# Altium schematic sheet FPGA_PART2.SchDoc
size 420 x 297 mm; SheetNumber: 30; SheetTotal: 32
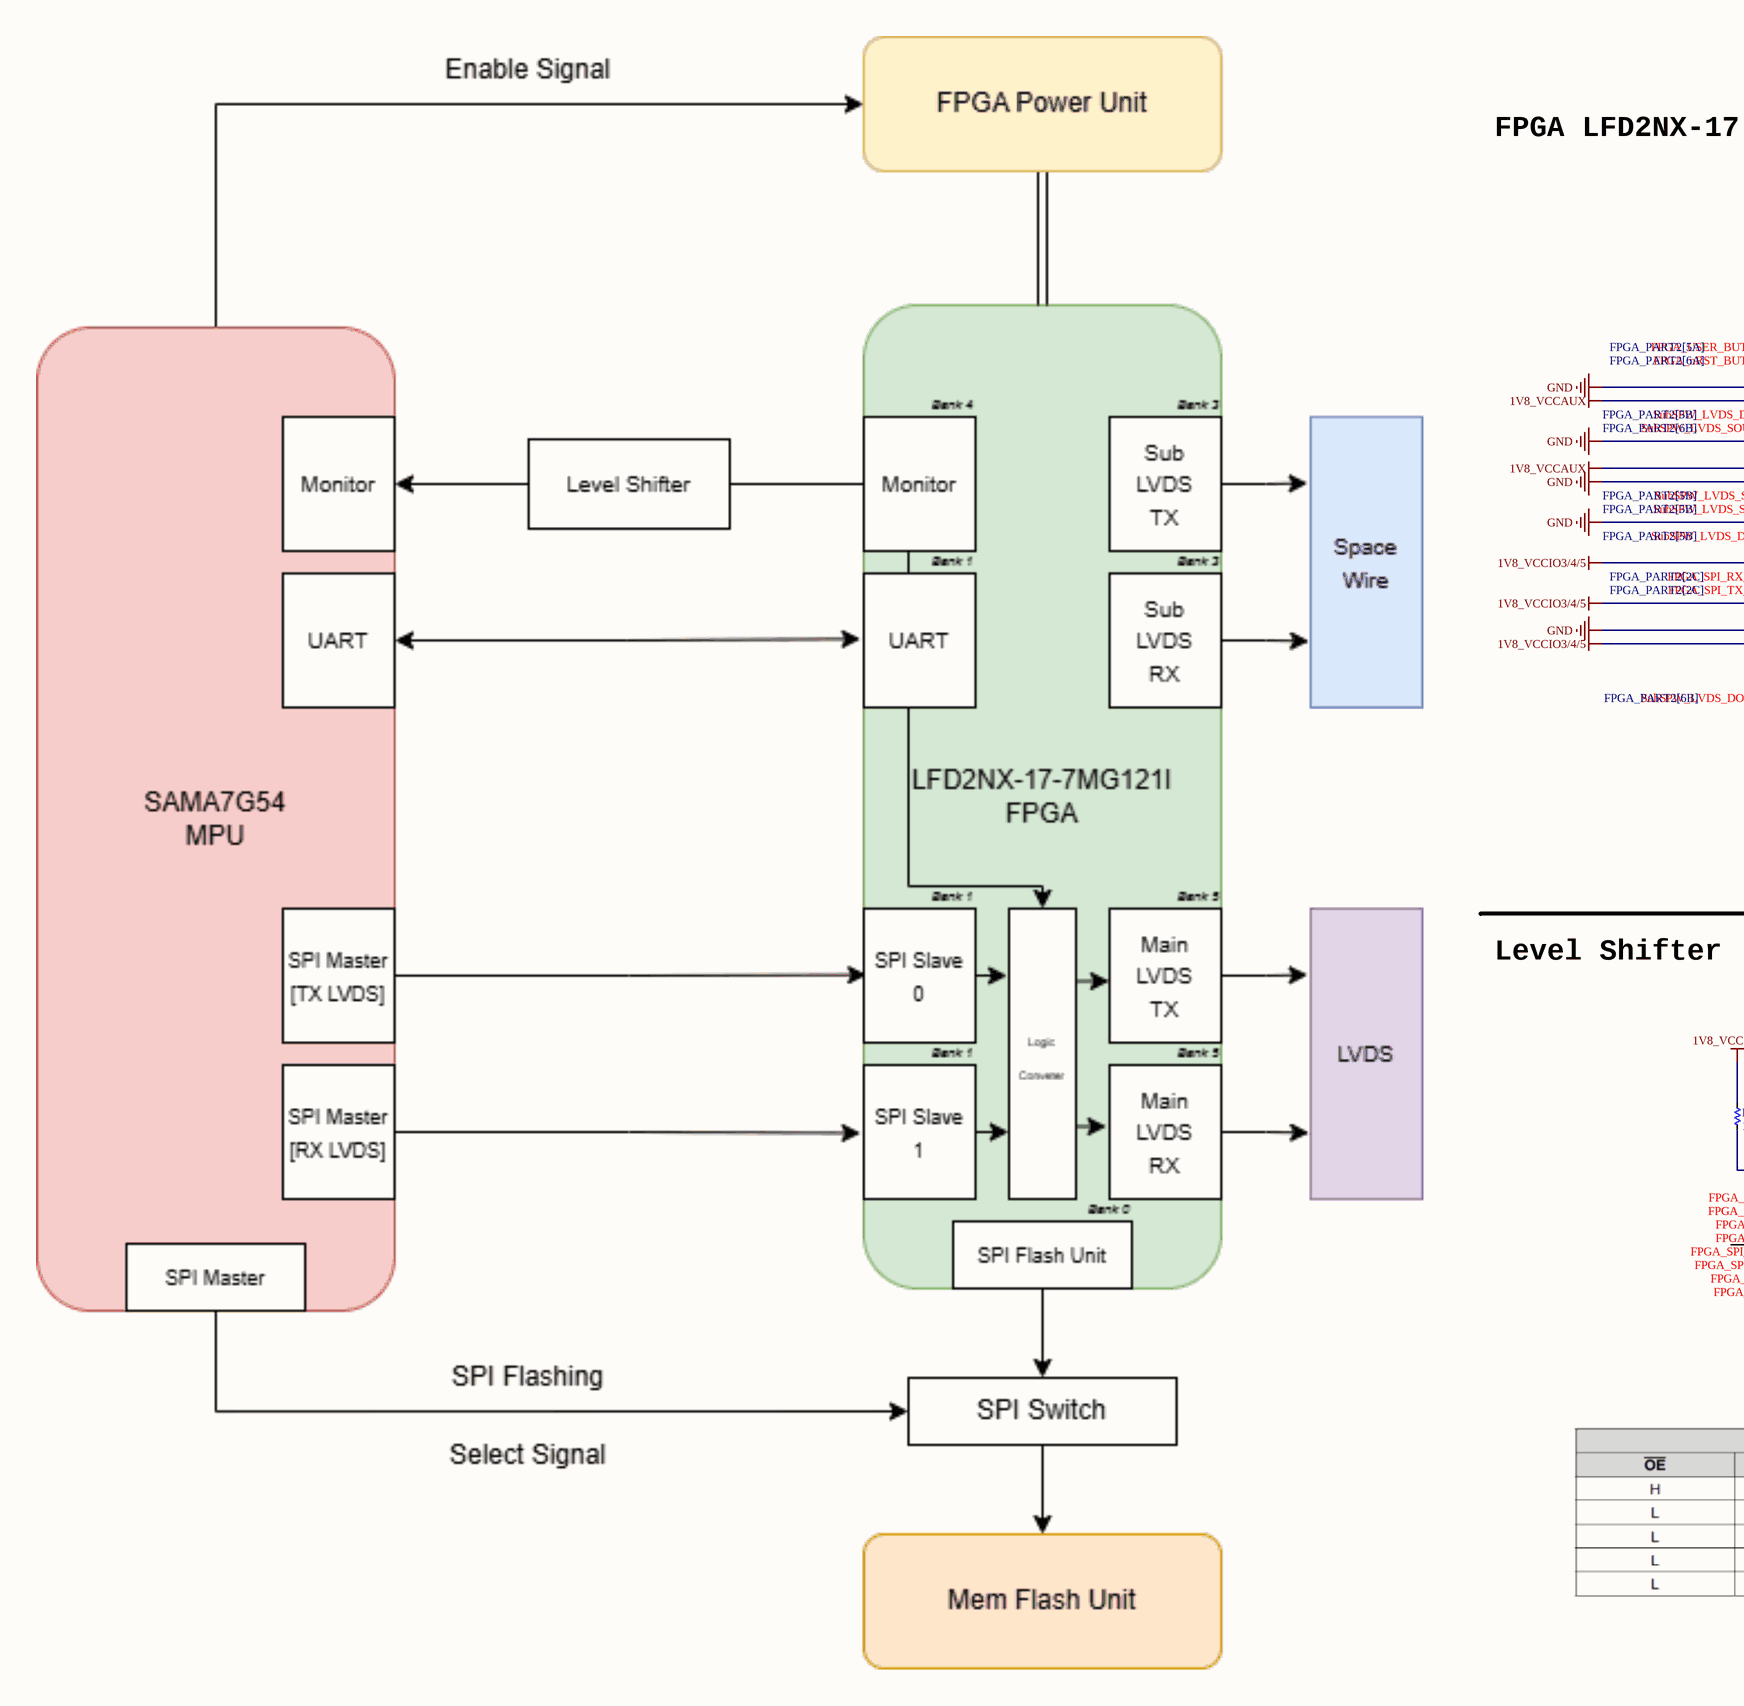
[diagram p0: FPGA_PART2.SchDoc, left]
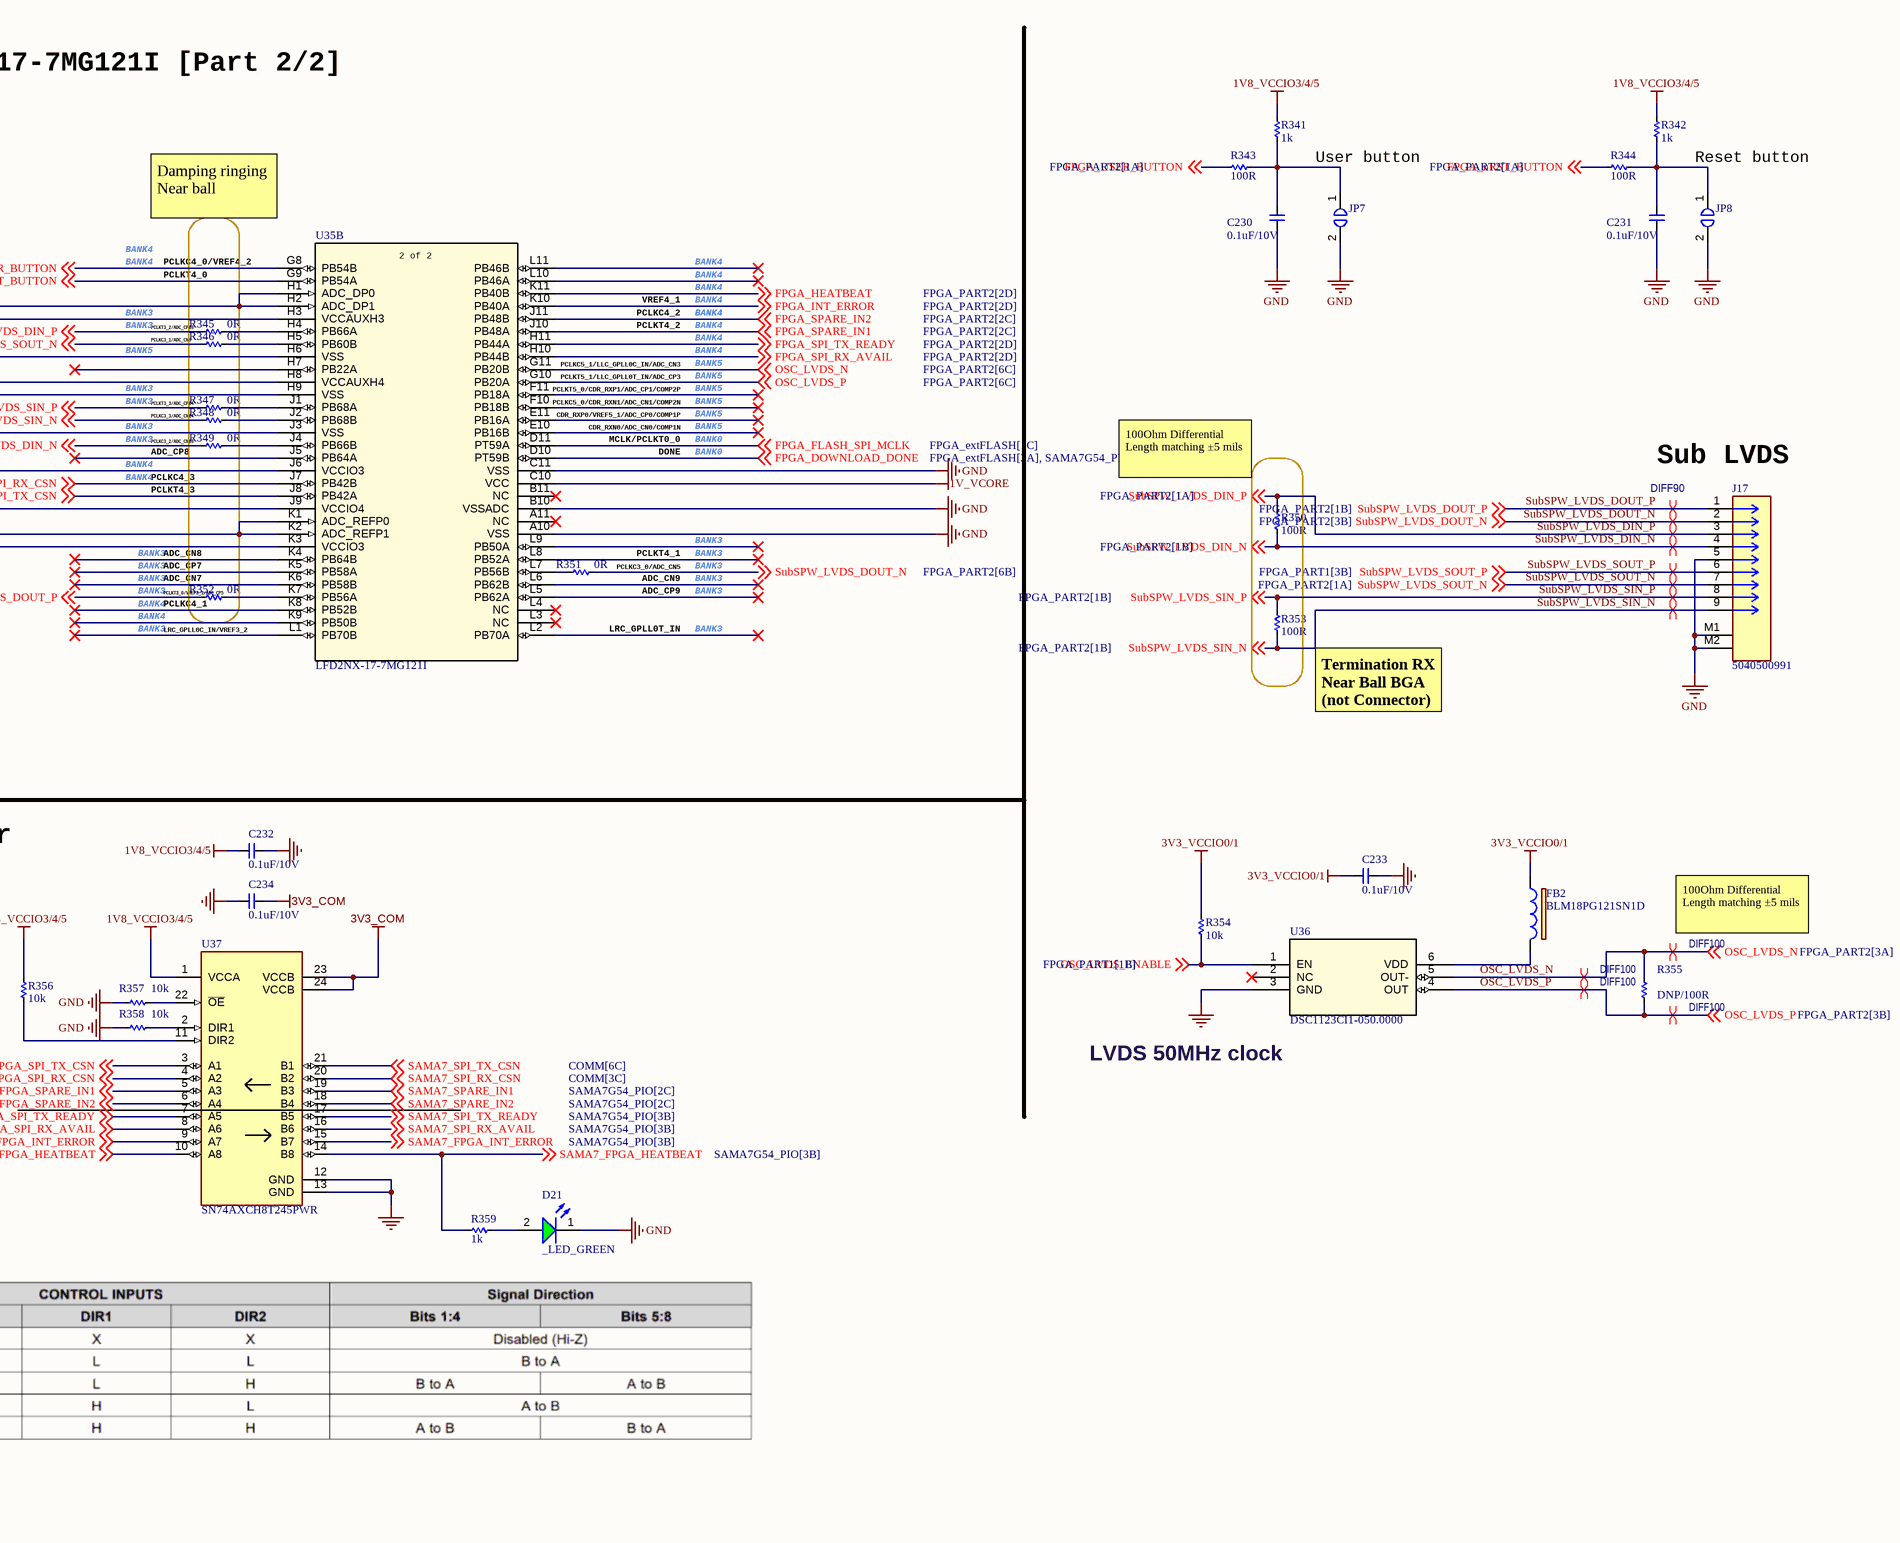
[diagram p1: FPGA_PART2.SchDoc, right]

## Parts
C230  0.1uF/10V  [CAP_C_1005X50_L]
C231  0.1uF/10V  [CAP_C_1005X50_L]
C232  0.1uF/10V  [CAP_C_1005X50_L]
C233  0.1uF/10V  [CAP_C_1005X50_L]
C234  0.1uF/10V  [CAP_C_1005X50_L]
D21  _LED_GREEN  [LED_0603]
FB2  BLM18PG121SN1D  [IND_C_1608X60]
J17  5040500991  [MOLEX_5040500991]
JP7  (no value)  [JUMPER_1608]
JP8  (no value)  [JUMPER_1608]
R341  1k  [RES_C_1005x30_L]
R342  1k  [RES_C_1005x30_L]
R343  100R  [RES_C_1005x30_L]
R344  100R  [RES_C_1005x30_L]
R345  0R  [RES_C_1005x30_L]
R346  0R  [RES_C_1005x30_L]
R347  0R  [RES_C_1005x30_L]
R348  0R  [RES_C_1005x30_L]
R349  0R  [RES_C_1005x30_L]
R350  100R  [RES_C_1005x30_L]
R351  0R  [RES_C_1005x30_L]
R352  0R  [RES_C_1005x30_L]
R353  100R  [RES_C_1005x30_L]
R354  10k  [RES_C_1005x30_L]
R355  DNP/100R  [RES_C_1005x30_L]
R356  10k  [RES_C_1005x30_L]
R357  10k  [RES_C_1005x30_L]
R358  10k  [RES_C_1005x30_L]
R359  1k  [RES_C_1005x30_L]
U35  LFD2NX-17-7MG121I  [csfBGA121_LAT]  (part B of 2)
U36  DSC1123CI1-050.0000  [VDFN6_3P2X2P5_MCH]
U37  SN74AXCH8T245PWR  [SOP65P640X120-24N]

## Nets
1V8_VCCAUX: U35.H3(VCCAUXH3) U35.H8(VCCAUXH4)
1V8_VCCIO3/4/5: C232.2 R341.2 R342.2 R356.2 U35.J6(VCCIO3) U35.J9(VCCIO4) U35.K3(VCCIO3) U37.1(VCCA)
1V_VCORE: U35.C10(VCC)
3V3_COM: C234.2 U37.23(VCCB) U37.24(VCCB)
3V3_VCCIO0/1: C233.2 FB2.2 R354.2
GND: C230.1 C231.1 C232.1 C233.1 C234.1 D21.1(K) J17.5 J17.M1 J17.M2 JP7.2 JP8.2 R357.1 R358.1 U35.A10(VSS) U35.B10(VSSADC) U35.C11(VSS) U35.H1(ADC_DP0) U35.H2(ADC_DP1) U35.H6(VSS) U35.H9(VSS) U35.J3(VSS) U35.K1(ADC_REFP0) U35.K2(ADC_REFP1) U36.3(GND) U37.12(GND) U37.13(GND)
FPGA_DOWNLOAD_DONE: U35.D10(PT59B) ; off-sheet FPGA_DOWNLOAD_DONE
FPGA_FLASH_SPI_MCLK: U35.D11(PT59A) ; off-sheet FPGA_FLASH_SPI_MCLK
FPGA_HEATBEAT: U35.K11(PB40B) U37.10(A8) ; off-sheet FPGA_HEATBEAT
FPGA_INT_ERROR: U35.K10(PB40A) U37.9(A7) ; off-sheet FPGA_INT_ERROR
FPGA_nRST_BUTTON: R344.1 U35.G9(PB54A) ; off-sheet FPGA_nRST_BUTTON
FPGA_SPARE_IN1: U35.J10(PB48A) U37.5(A3) ; off-sheet FPGA_SPARE_IN1
FPGA_SPARE_IN2: U35.J11(PB48B) U37.6(A4) ; off-sheet FPGA_SPARE_IN2
FPGA_SPI_RX_AVAIL: U35.H10(PB44B) U37.8(A6) ; off-sheet FPGA_SPI_RX_AVAIL
FPGA_SPI_RX_CSN: U35.J7(PB42B) U37.4(A2) ; off-sheet FPGA_SPI_RX_CSN
FPGA_SPI_TX_CSN: U35.J8(PB42A) U37.3(A1) ; off-sheet FPGA_SPI_TX_CSN
FPGA_SPI_TX_READY: U35.H11(PB44A) U37.7(A5) ; off-sheet FPGA_SPI_TX_READY
FPGA_USER_BUTTON: R343.1 U35.G8(PB54B) ; off-sheet FPGA_USER_BUTTON
OSC_LVDS_ENABLE: R354.1 U36.1(EN) ; off-sheet OSC_LVDS_ENABLE
OSC_LVDS_N: R355.1 U35.G11(PB20B) U36.5(OUT-) ; off-sheet OSC_LVDS_N
OSC_LVDS_P: R355.2 U35.G10(PB20A) U36.4(OUT) ; off-sheet OSC_LVDS_P
SAMA7_FPGA_HEATBEAT: R359.2 U37.14(B8) ; off-sheet SAMA7_FPGA_HEATBEAT
SAMA7_FPGA_INT_ERROR: U37.15(B7) ; off-sheet SAMA7_FPGA_INT_ERROR
SAMA7_SPARE_IN1: U37.19(B3) ; off-sheet SAMA7_SPARE_IN1
SAMA7_SPARE_IN2: U37.18(B4) ; off-sheet SAMA7_SPARE_IN2
SAMA7_SPI_RX_AVAIL: U37.16(B6) ; off-sheet SAMA7_SPI_RX_AVAIL
SAMA7_SPI_RX_CSN: U37.20(B2) ; off-sheet SAMA7_SPI_RX_CSN
SAMA7_SPI_TX_CSN: U37.21(B1) ; off-sheet SAMA7_SPI_TX_CSN
SAMA7_SPI_TX_READY: U37.17(B5) ; off-sheet SAMA7_SPI_TX_READY
SubSPW_LVDS_DIN_N: J17.4 R349.2 R350.2 ; off-sheet SubSPW_LVDS_DIN_N
SubSPW_LVDS_DIN_P: J17.3 R345.2 R350.1 ; off-sheet SubSPW_LVDS_DIN_P
SubSPW_LVDS_DOUT_N: J17.2 R351.1 ; off-sheet SubSPW_LVDS_DOUT_N
SubSPW_LVDS_DOUT_P: J17.1 R352.2 ; off-sheet SubSPW_LVDS_DOUT_P
SubSPW_LVDS_SIN_N: J17.9 R348.2 R353.2 ; off-sheet SubSPW_LVDS_SIN_N
SubSPW_LVDS_SIN_P: J17.8 R347.2 R353.1 ; off-sheet SubSPW_LVDS_SIN_P
SubSPW_LVDS_SOUT_N: J17.7 R346.2 ; off-sheet SubSPW_LVDS_SOUT_N
SubSPW_LVDS_SOUT_P: J17.6 ; off-sheet SubSPW_LVDS_SOUT_P
NetC230_2: C230.2 JP7.1 R341.1 R343.2
NetC231_2: C231.2 JP8.1 R342.1 R344.2
NetD21_2: D21.2(A) R359.1
NetFB2_1: FB2.1 U36.6(VDD)
NetR345_1: R345.1 U35.H4(PB66A)
NetR346_1: R346.1 U35.H5(PB60B)
NetR347_1: R347.1 U35.J1(PB68A)
NetR348_1: R348.1 U35.J2(PB68B)
NetR349_1: R349.1 U35.J4(PB66B)
NetR351_2: R351.2 U35.L7(PB56B)
NetR352_1: R352.1 U35.K7(PB56A)
NetR356_1: R356.1 U37.11(DIR2)
NetR357_2: R357.2 U37.22(~{OE})
NetR358_2: R358.2 U37.2(DIR1)

Not connected (* = marked no-connect by the designer): U35 A11(NC)* B11(NC)* E10(PB16B)* E11(PB16A)* F10(PB18B)* F11(PB18A)* H7(PB22A)* J5(PB64A)* K4(PB64B)* K5(PB58A)* K6(PB58B)* K8(PB52B)* K9(PB50B)* L1(PB70B)* L2(PB70A)* L3(NC)* L4(NC)* L5(PB62A)* L6(PB62B)* L8(PB52A)* L9(PB50A)* L10(PB46A)* L11(PB46B)*; U36 2(NC)*

## Layout directives
differential pair; differential pair class DIFF90; net class DIFF90; rule Matched Net Lengths [Tolerance = 4mil]: SubSPW_LVDS_DIN_N, SubSPW_LVDS_DIN_P, SubSPW_LVDS_DOUT_N, SubSPW_LVDS_DOUT_P, SubSPW_LVDS_SIN_N, SubSPW_LVDS_SIN_P, SubSPW_LVDS_SOUT_N, SubSPW_LVDS_SOUT_P
differential pair; differential pair class DIFF100; net class DIFF100; rule Matched Net Lengths [Tolerance = 4mil]: OSC_LVDS_N, OSC_LVDS_P

## Notes on the sheet
- FPGA LFD2NX-17-7MG121I [Part 2/2]
- User button
- Reset button
- Damping ringing
  Near ball
- BANK4
- PCLKC4_0/VREF4_2
- PCLKT4_0
- VREF4_1
- BANK3
- BANK5
- PCLKT3_2/ADC_CP13
- PCLKC3_1/ADC_CN6
- PCLKC5_1/LLC_GPLL0C_IN/ADC_CN3
- PCLKT4_2
- PCLKC4_2
- PCLKT3_3/ADC_CP14
- PCLKC3_3/ADC_CN14
- CDR_RXN0/ADC_CN0/COMP1N
- CDR_RXP0/VREF5_1/ADC_CP0/COMP1P
- PCLKC5_0/CDR_RXN1/ADC_CN1/COMP2N
- PCLKT5_0/CDR_RXP1/ADC_CP1/COMP2P
- PCLKT5_1/LLC_GPLL0T_IN/ADC_CP3
- PCLKC3_2/ADC_CN13
- ADC_CP8
- (near R349) PCLKC4_3
- PCLKT4_3
- DONE
- MCLK/PCLKT0_0
- BANK0
- (near R350) 100Ohm Differential
  Length matching ±5 mils
- (near J17) Sub LVDS
- (near R352) ADC_CN8
- PCLKT4_1
- (near R352) BANK3
- (near R352) BANK4
- (near R352) ADC_CP7
- (near R352) ADC_CN7
- (near R352) PCLKT3_0/VREF3_1/ADC_CP5
- (near R352) PCLKC4_1
- ADC_CP9
- ADC_CN9
- (near R351) PCLKC3_0/ADC_CN5
- (near R352) LRC_GPLL0C_IN/VREF3_2
- LRC_GPLL0T_IN
- (near R353) Termination RX
  Near Ball BGA (not Connector)
- Level Shifter
- 100Ohm Differential
  Length matching ±5 mils
- LVDS 50MHz clock
- Project:
- Sub-system:
- Design by:
- Sheet title:
- Sheet
- A3
- of
- Checked by:
- Approved by:
- Revision:
- Document No:
- Size:
- Date:
- (in symbol LFD2NX-17-7MG121I, part B) 2 of 2

## Library data of the parts
C230-C234 = _CAP_C_2: CAP
D21 = LED_GREEN: LED GREEN CLEAR 0603 SMD
FB2 = BLM18PG121SN1D: FERRITE BEAD 120 OHM 0603 1LN; Manufacturer_Name: Murata; Copyright: Copyright (C) 2025 Ultra Librarian. All rights reserved.; Manufacturer_Part_Number: BLM18PG121SN1D
J17 = 5040500991: Connector Header Surface Mount, Right Angle 9 position 0.059" (1.50mm)
JP7 JP8 = JUMPER_1_1
R341-R359 = _RES_B_2: RES
U35 = LFD2NX-17-7MG121I: Description; Manufacturer_Name: Lattice; Type: Embedded; Copyright: Copyright (C) 2025 Ultra Librarian. All rights reserved.; Manufacturer_Part_Number: LFD2NX-17-7MG121I; RefDes: RefDes
U36 = DSC11x3CIx-x: No Description Available; Manufacturer_Name: Microchip; Manufacturer_Part_Number: DSC1103CI2-180.0000T; Copyright: Copyright (C) 2026 Ultra Librarian. All rights reserved.; RefDes: RefDes; Type: Type
U37 = IC_voltage_level_SN74AXCH8T245PWR: 8-Bit Dual-Supply Bus Transceiver; MF: Texas Instruments; MP: SN74AXCH8T245PWR; Value: *; Check_prices: https://www.snapeda.com/parts/SN74AXCH8T245PWR/Texas+Instruments/view-part/?ref=eda; SnapEDA_Link: https://www.snapeda.com/parts/SN74AXCH8T245PWR/Texas+Instruments/view-part/?ref=snap; Price: None; Availability: In Stock; Purchase-URL: https://pricing.snapeda.com/search/part/SN74AXCH8T245PWR/?ref=eda; Package: TSSOP-24 Texas Instruments